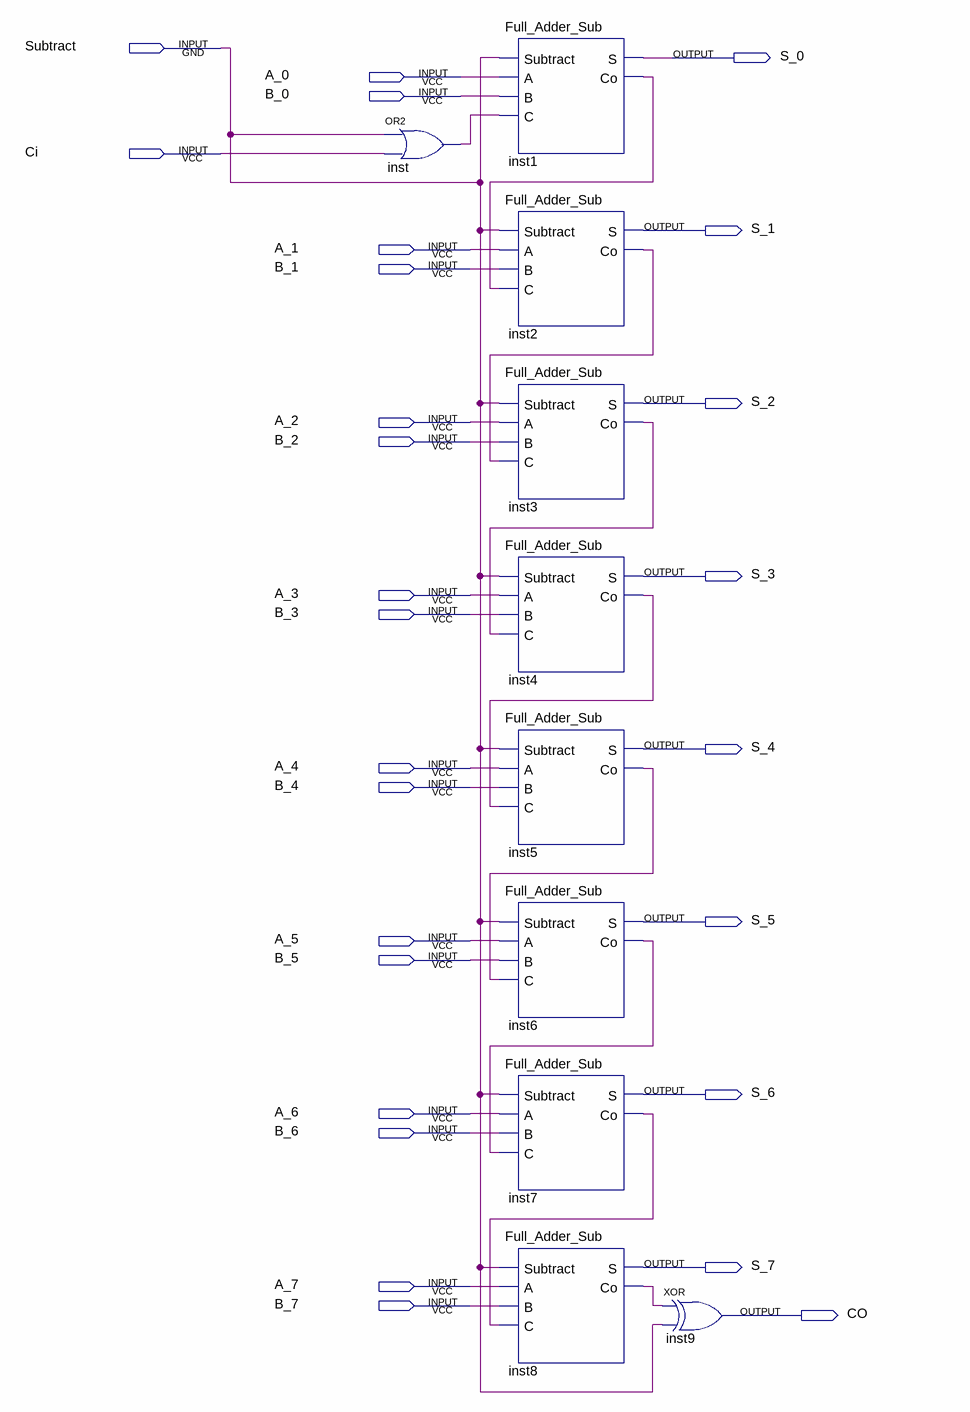
[diagram p0: schematic sheet]
// Quartus schematic 8_B_Ripple_Adder.bdf as structural Verilog: 10 symbols, 27 pins
module \8_B_Ripple_Adder  (
  input  Subtract,
  input  A_0,
  input  B_0,
  input  Ci,
  input  A_1,
  input  B_1,
  input  A_2,
  input  B_2,
  input  A_3,
  input  B_3,
  input  A_4,
  input  B_4,
  input  A_5,
  input  B_5,
  input  A_6,
  input  B_6,
  input  A_7,
  input  B_7,
  output S_0,
  output S_1,
  output S_2,
  output S_3,
  output S_4,
  output S_5,
  output S_6,
  output S_7,
  output CO
);

  wire inst1_co, inst2_co, inst3_co, inst4_co, inst5_co, inst6_co, inst7_co, inst8_co, inst_out;

  or inst (inst_out, Subtract, Ci);
  Full_Adder_Sub inst1 (.Subtract(Subtract), .A(A_0), .B(B_0), .C(inst_out), .S(S_0), .Co(inst1_co));
  Full_Adder_Sub inst2 (.Subtract(Subtract), .A(A_1), .B(B_1), .C(inst1_co), .S(S_1), .Co(inst2_co));
  Full_Adder_Sub inst3 (.Subtract(Subtract), .A(A_2), .B(B_2), .C(inst2_co), .S(S_2), .Co(inst3_co));
  Full_Adder_Sub inst4 (.Subtract(Subtract), .A(A_3), .B(B_3), .C(inst3_co), .S(S_3), .Co(inst4_co));
  Full_Adder_Sub inst5 (.Subtract(Subtract), .A(A_4), .B(B_4), .C(inst4_co), .S(S_4), .Co(inst5_co));
  Full_Adder_Sub inst6 (.Subtract(Subtract), .A(A_5), .B(B_5), .C(inst5_co), .S(S_5), .Co(inst6_co));
  Full_Adder_Sub inst7 (.Subtract(Subtract), .A(A_6), .B(B_6), .C(inst6_co), .S(S_6), .Co(inst7_co));
  Full_Adder_Sub inst8 (.Subtract(Subtract), .A(A_7), .B(B_7), .C(inst7_co), .S(S_7), .Co(inst8_co));
  xor inst9 (CO, inst8_co, Subtract);
endmodule
